# Altium schematic sheet USB.SchDoc: Evaluation Board 3.2
size A3; Organization: Toradex AG; Address1: Altsagenstrasse 5; Address2: Horw; Address3: 6048; Address4: Switzerland; DocumentNumber: 6; Revision: V3.2; SheetNumber: 6; SheetTotal: 23; PageSetup: Record=PageOptions|CenterHorizontal=True|CenterVertical=True|PrintScale=0.73|XCorrection=1.00|YCorrection=1.00|PrintKind=0|BorderSize=5000000|LeftOffset=0|BottomOffset=0|Orientation=2|PaperLength=1000|PaperWidth=1000|Scale=100|PaperSource=7|PrintQuality=-4|MediaType=1|DitherType=10|PaperKind=A4|PrintScaleMode=1
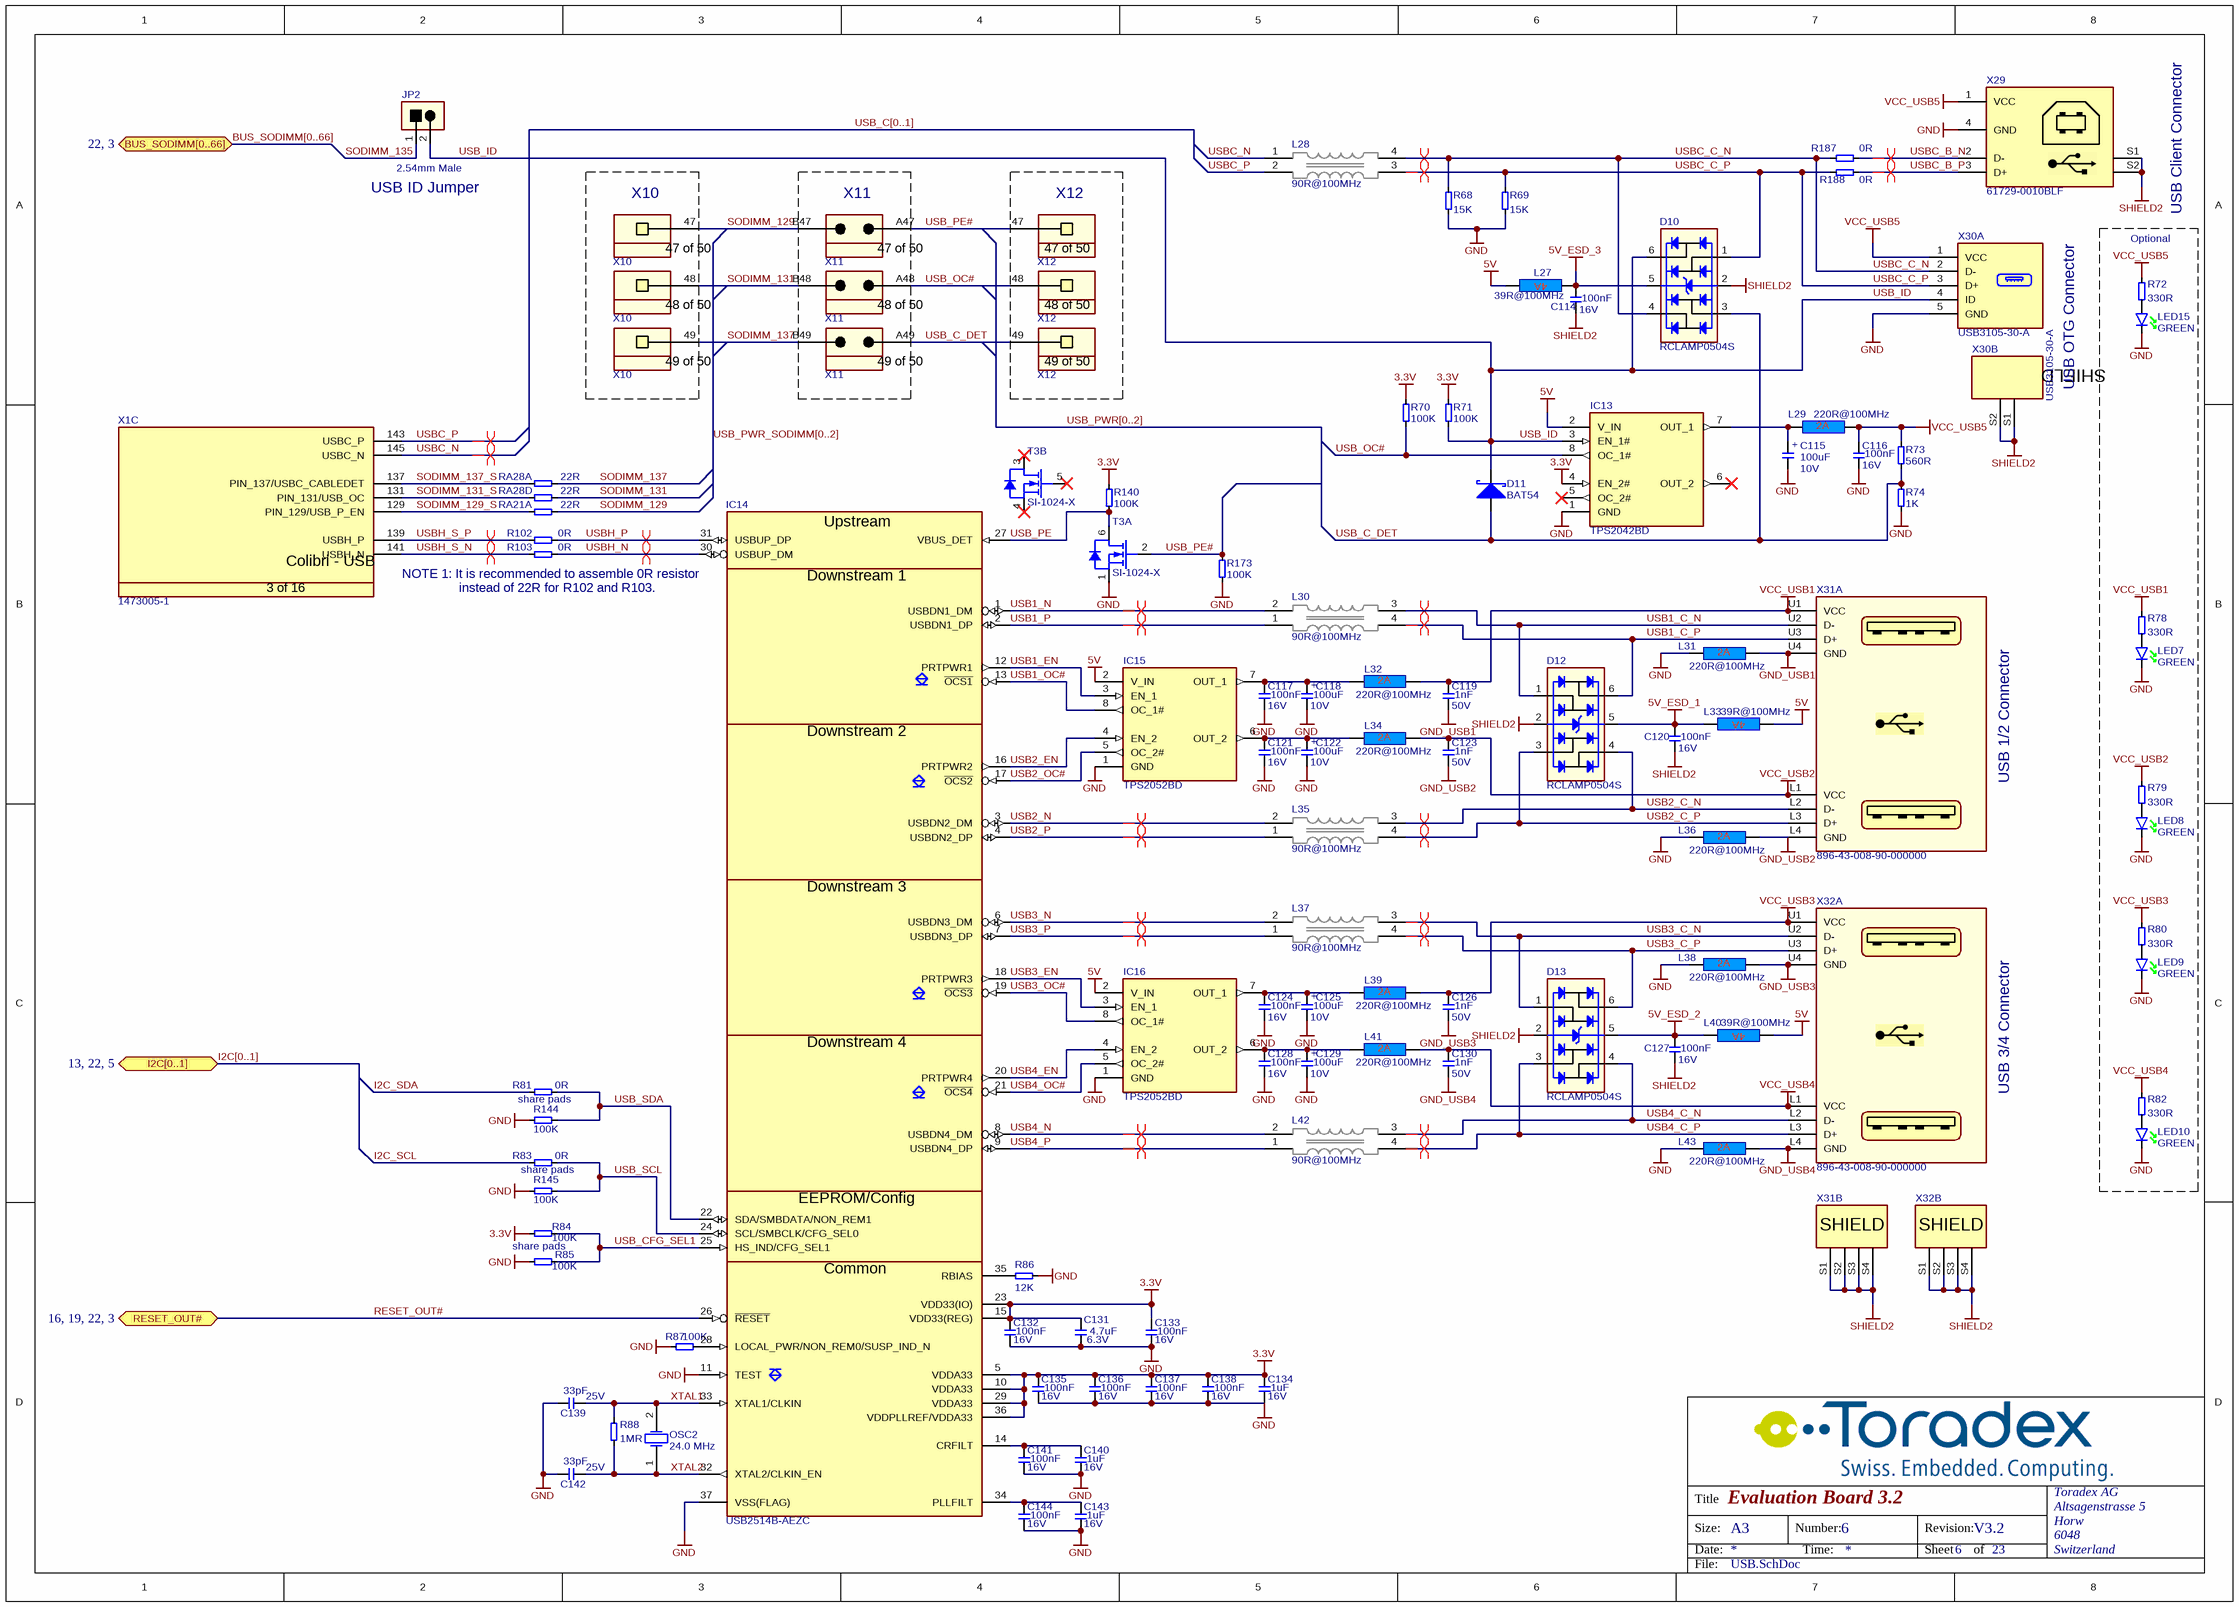
[diagram p0: USB.SchDoc]

## Parts
C114  Rating: 16V  [T_CAPC0603X33N]  (hidden comment: 100nF)
C115  Rating: 10V  [CAPMP6032X280N]  (hidden comment: 100uF)
C116  Rating: 16V  [T_CAPC0603X33N]  (hidden comment: 100nF)
C117  Rating: 16V  [T_CAPC0603X33N]  (hidden comment: 100nF)
C118  Rating: 10V  [CAPMP6032X280N]  (hidden comment: 100uF)
C119  Rating: 50V  [T_CAPC0603X33N]  (hidden comment: 1nF)
C120  Rating: 16V  [T_CAPC0603X33N]  (hidden comment: 100nF)
C121  Rating: 16V  [T_CAPC0603X33N]  (hidden comment: 100nF)
C122  Rating: 10V  [CAPMP6032X280N]  (hidden comment: 100uF)
C123  Rating: 50V  [T_CAPC0603X33N]  (hidden comment: 1nF)
C124  Rating: 16V  [T_CAPC0603X33N]  (hidden comment: 100nF)
C125  Rating: 10V  [CAPMP6032X280N]  (hidden comment: 100uF)
C126  Rating: 50V  [T_CAPC0603X33N]  (hidden comment: 1nF)
C127  Rating: 16V  [T_CAPC0603X33N]  (hidden comment: 100nF)
C128  Rating: 16V  [T_CAPC0603X33N]  (hidden comment: 100nF)
C129  Rating: 10V  [CAPMP6032X280N]  (hidden comment: 100uF)
C130  Rating: 50V  [T_CAPC0603X33N]  (hidden comment: 1nF)
C131  Rating: 6.3V  [T_CAPC0603X33N]  (hidden comment: 4.7uF)
C132  Rating: 16V  [T_CAPC0603X33N]  (hidden comment: 100nF)
C133  Rating: 16V  [T_CAPC0603X33N]  (hidden comment: 100nF)
C134  Rating: 16V  [T_CAPC0603X33N]  (hidden comment: 1uF)
C135  Rating: 16V  [T_CAPC0603X33N]  (hidden comment: 100nF)
C136  Rating: 16V  [T_CAPC0603X33N]  (hidden comment: 100nF)
C137  Rating: 16V  [T_CAPC0603X33N]  (hidden comment: 100nF)
C138  Rating: 16V  [T_CAPC0603X33N]  (hidden comment: 100nF)
C139  Rating: 25V  [T_CAPC0603X33N]  (hidden comment: 33pF)
C140  Rating: 16V  [T_CAPC0603X33N]  (hidden comment: 1uF)
C141  Rating: 16V  [T_CAPC0603X33N]  (hidden comment: 100nF)
C142  Rating: 25V  [T_CAPC0603X33N]  (hidden comment: 33pF)
C143  Rating: 16V  [T_CAPC0603X33N]  (hidden comment: 1uF)
C144  Rating: 16V  [T_CAPC0603X33N]  (hidden comment: 100nF)
D10  RCLAMP0504S  [T_SOT95P285X90-6N]
D11  BAT54  [SOT95P230X110-3N]
D12  RCLAMP0504S  [T_SOT95P285X90-6N]
D13  RCLAMP0504S  [T_SOT95P285X90-6N]
IC13  TPS2042BD  [SOIC127P600X173-8N]
IC14  Manufacturer Part No.: USB2514B-AEZC  [T_SMSC_USB2514B-AEZC]  (hidden comment: USB2514B)
IC15  TPS2052BD  [SOIC127P600X173-8N]
IC16  TPS2052BD  [SOIC127P600X173-8N]
JP2  TSW-101-07-G-D  [T_Samtec_TSW-101-07-G-D]  (value not drawn)
L27  39R@100MHz  [INDC2013X130N]
L28  90R@100MHz  [T_Murata_DLW21SN900SQ2]
L29  220R@100MHz  [INDC1608X95N]
L30  90R@100MHz  [T_Murata_DLW21SN900SQ2]
L31  220R@100MHz  [INDC1608X95N]
L32  220R@100MHz  [INDC1608X95N]
L33  39R@100MHz  [INDC2013X130N]
L34  220R@100MHz  [INDC1608X95N]
L35  90R@100MHz  [T_Murata_DLW21SN900SQ2]
L36  220R@100MHz  [INDC1608X95N]
L37  90R@100MHz  [T_Murata_DLW21SN900SQ2]
L38  220R@100MHz  [INDC1608X95N]
L39  220R@100MHz  [INDC1608X95N]
L40  39R@100MHz  [INDC2013X130N]
L41  220R@100MHz  [INDC1608X95N]
L42  90R@100MHz  [T_Murata_DLW21SN900SQ2]
L43  220R@100MHz  [INDC1608X95N]
LED7  Color: GREEN  [T_Osram_T670_GREEN]  (hidden comment: LG T670-K1L2-1)
LED8  Color: GREEN  [T_Osram_T670_GREEN]  (hidden comment: LG T670-K1L2-1)
LED9  Color: GREEN  [T_Osram_T670_GREEN]  (hidden comment: LG T670-K1L2-1)
LED10  Color: GREEN  [T_Osram_T670_GREEN]  (hidden comment: LG T670-K1L2-1)
LED15  Color: GREEN  [T_Osram_T670_GREEN]  (hidden comment: LG T670-K1L2-1)
OSC2  value 24.0 MHz  [T_HORIZON-HEX24]  (hidden comment: HEX24-24000MHz-18-50R-F-H2-T2-W2-T)
R68  15K  [T_RESC0603X30N]
R69  15K  [T_RESC0603X30N]
R70  100K  [t_RESC0603X30N]
R71  100K  [t_RESC0603X30N]
R72  330R  [T_RESC0603X30N]
R73  560R  [T_RESC0603X30N]
R74  1K  [T_RESC0603X30N]
R78  330R  [T_RESC0603X30N]
R79  330R  [T_RESC0603X30N]
R80  330R  [T_RESC0603X30N]
R81  0R  [T_RESC0603X30N]
R82  330R  [T_RESC0603X30N]
R83  0R  [T_RESC0603X30N]
R84  100K  [T_RESC0603X30N]
R85  100K  [T_RESC0603X30N]
R86  12K  [T_RESC0603X30N]
R87  100K  [T_RESC0603X30N]
R88  1MR  [T_RESC0603X30N]
R102  0R  [T_RESC0603X30N]
R103  0R  [T_RESC0603X30N]
R140  100K  [T_RESC0603X30N]
R144  100K  [T_RESC0603X30N]
R145  100K  [T_RESC0603X30N]
R173  100K  [T_RESC0603X30N]
R187  0R  [T_RESC0603X30N]
R188  0R  [T_RESC0603X30N]
RA21  22R  [T_Resistor_Array_X4]  (part A of 4)
RA28  22R  [T_Resistor_Array_X4]  (parts A,D of 4)
T3  Manufacturer Part No.: SI-1024-X  [SOTFL50P160X60-6N]  (hidden comment: T-Vishay-SI-1024X-N)  (parts A,B of 2)
X1  Manufacturer Part No.: 1473005-1  [T_Tyco_1473005-1]  (hidden comment: CON-Tyco-1473005-1-200-0.6mm)  (part C of 16)
X10  SSW-110-01-G-S  [T_Samtec_SSW-110-01-G-S]  (value not drawn)  (parts 47,48,49 of 50)
X11  TSW-110-07-G-D  [T_Samtec_TSW-110-07-G-D]  (value not drawn)  (parts 47,48,49 of 50)
X12  SSW-110-01-G-S  [T_Samtec_SSW-110-01-G-S]  (value not drawn)  (parts 47,48,49 of 50)
X29  61729-0010BLF  [T_FCI_61729-0010BLF]
X30  Manufacturer Part No.: USB3105-30-A  [T_GCT_USB3105-30-A]  (hidden comment: CON-GCT-USB3105-30-A)  (parts A,B of 2)
X31  896-43-008-90-000000  [T_MMMC_896-43-008-90-000000]  (parts A,B of 2)
X32  896-43-008-90-000000  [T_MMMC_896-43-008-90-000000]  (parts A,B of 2)

## Blocks framed on the sheet
X10: X10
X11: X11
X12: X12
USB Client Connector: LED7-LED10 LED15 R72 R78-R80 R82

## Ports
BUS_SODIMM[0..66] (bidir, see 22, 3), I2C[0..1] (bidir, see 13, 22, 5), RESET_OUT# (bidir, see 16, 19, 22, 3)

## Nets
3.3V: C131.2 C132.2 C133.2 C134.2 C135.2 C136.2 C137.2 C138.2 IC13.4(EN_2#) IC14.5(VDDA33) IC14.10(VDDA33) IC14.15(VDD33(REG)) IC14.23(VDD33(IO)) IC14.29(VDDA33) IC14.36(VDDPLLREF/VDDA33) R70.2 R71.1 R84.2 R140.2
5V: IC13.2(V_IN) IC15.2(V_IN) IC16.2(V_IN) L27.2 L33.1 L40.1
5V_ESD_1: C120.2 D12.5 L33.2
5V_ESD_2: C127.2 D13.5 L40.2
5V_ESD_3: C114.2 D10.5 L27.1
GND: C115.2 C116.1 C117.1 C118.2 C121.1 C122.2 C124.1 C125.2 C128.1 C129.2 C131.1 C132.1 C133.1 C134.1 C135.1 C136.1 C137.1 C138.1 C139.1 C140.1 C141.1 C142.1 C143.1 C144.1 IC13.1(GND) IC14.11(TEST) IC14.37(VSS(FLAG)) IC15.1(GND) IC16.1(GND) L31.1 L36.1 L38.1 L43.1 LED7.K LED8.K LED9.K LED10.K LED15.K R68.1 R69.1 R74.1 R85.2 R86.1 R87.1 R144.2 R145.2 R173.1 T3.1(S) X29.4(GND) X30.5(GND)
GND_USB1: C119.1 L31.2 X31.U4(GND)
GND_USB2: C123.1 L36.2 X31.L4(GND)
GND_USB3: C126.1 L38.2 X32.U4(GND)
GND_USB4: C130.1 L43.2 X32.L4(GND)
SHIELD2: C114.1 C120.1 C127.1 D10.2 D12.2 D13.2 X29.S1 X29.S2 X30.S1(SHIELD) X30.S2(SHIELD) X31.S1(SHIELD) X31.S2(SHIELD) X31.S3(SHIELD) X31.S4(SHIELD) X32.S1(SHIELD) X32.S2(SHIELD) X32.S3(SHIELD) X32.S4(SHIELD)
VCC_USB1: C119.2 L32.2 R78.2 X31.U1(VCC)
VCC_USB2: C123.2 L34.2 R79.2 X31.L1(VCC)
VCC_USB3: C126.2 L39.2 R80.2 X32.U1(VCC)
VCC_USB4: C130.2 L41.2 R82.2 X32.L1(VCC)
VCC_USB5: C116.2 L29.2 R72.2 R73.2 X29.1(VCC) X30.1(VCC)
I2C_SCL: R83.1
I2C_SDA: R81.1
RESET_OUT#: IC14.26(~{RESET}) ; port RESET_OUT#
SODIMM_129: RA21.5 X10.47 X11.B47
SODIMM_129_S: RA21.1 X1.129(PIN_129/USB_P_EN)
SODIMM_131: RA28.8 X10.48 X11.B48
SODIMM_131_S: RA28.4 X1.131(PIN_131/USB_OC)
SODIMM_135: JP2.1
SODIMM_137: RA28.5 X10.49 X11.B49
SODIMM_137_S: RA28.1 X1.137(PIN_137/USBC_CABLEDET)
USB1_C_N: D12.1 L30.3 X31.U2(D-)
USB1_C_P: D12.6 L30.4 X31.U3(D+)
USB1_EN: IC14.12(PRTPWR1) IC15.3(EN_1)
USB1_N: IC14.1(USBDN1_DM) L30.2
USB1_OC#: IC14.13(~{OCS1}) IC15.8(OC_1#)
USB1_P: IC14.2(USBDN1_DP) L30.1
USB2_C_N: D12.4 L35.3 X31.L2(D-)
USB2_C_P: D12.3 L35.4 X31.L3(D+)
USB2_EN: IC14.16(PRTPWR2) IC15.4(EN_2)
USB2_N: IC14.3(USBDN2_DM) L35.2
USB2_OC#: IC14.17(~{OCS2}) IC15.5(OC_2#)
USB2_P: IC14.4(USBDN2_DP) L35.1
USB3_C_N: D13.1 L37.3 X32.U2(D-)
USB3_C_P: D13.6 L37.4 X32.U3(D+)
USB3_EN: IC14.18(PRTPWR3) IC16.3(EN_1)
USB3_N: IC14.6(USBDN3_DM) L37.2
USB3_OC#: IC14.19(~{OCS3}) IC16.8(OC_1#)
USB3_P: IC14.7(USBDN3_DP) L37.1
USB4_C_N: D13.4 L42.3 X32.L2(D-)
USB4_C_P: D13.3 L42.4 X32.L3(D+)
USB4_EN: IC14.20(PRTPWR4) IC16.4(EN_2)
USB4_N: IC14.8(USBDN4_DM) L42.2
USB4_OC#: IC14.21(~{OCS4}) IC16.5(OC_2#)
USB4_P: IC14.9(USBDN4_DP) L42.1
USB_C_DET: D10.3 D11.1 R73.1 R74.2 X11.A49 X12.49
USB_CFG_SEL1: IC14.25(HS_IND/CFG_SEL1) R84.1 R85.1
USB_ID: D10.6 D11.3 IC13.3(EN_1#) JP2.2 R71.2 X30.4(ID)
USB_OC#: IC13.8(OC_1#) R70.1 X11.A48 X12.48
USB_PE: IC14.27(VBUS_DET) R140.1 T3.6(D)
USB_PE#: R173.2 T3.2(G) X11.A47 X12.47
USB_SCL: IC14.24(SCL/SMBCLK/CFG_SEL0) R83.2 R145.1
USB_SDA: IC14.22(SDA/SMBDATA/NON_REM1) R81.2 R144.1
USBC_B_N: R187.2 X29.2(D-)
USBC_B_P: R188.2 X29.3(D+)
USBC_C_N: D10.4 L28.4 R68.2 R187.1 X30.2(D-)
USBC_C_P: D10.1 L28.3 R69.2 R188.1 X30.3(D+)
USBC_N: L28.1 X1.145(USBC_N)
USBC_P: L28.2 X1.143(USBC_P)
USBH_N: IC14.30(USBUP_DM) R103.2
USBH_P: IC14.31(USBUP_DP) R102.2
USBH_S_N: R103.1 X1.141(USBH_N)
USBH_S_P: R102.1 X1.139(USBH_P)
XTAL1: C139.2 IC14.33(XTAL1/CLKIN) OSC2.2(OSC2) R88.2
XTAL2: C142.2 IC14.32(XTAL2/CLKIN_EN) OSC2.1(OSC1) R88.1
NetC115_1: C115.1 IC13.7(OUT_1) L29.1
NetC117_2: C117.2 C118.1 IC15.7(OUT_1) L32.1
NetC121_2: C121.2 C122.1 IC15.6(OUT_2) L34.1
NetC124_2: C124.2 C125.1 IC16.7(OUT_1) L39.1
NetC128_2: C128.2 C129.1 IC16.6(OUT_2) L41.1
NetC140_2: C140.2 C141.2 IC14.14(CRFILT)
NetC143_2: C143.2 C144.2 IC14.34(PLLFILT)
NetIC14_28: IC14.28(LOCAL_PWR/NON_REM0/SUSP_IND_N) R87.2
NetIC14_35: IC14.35(RBIAS) R86.2
NetLED7_A: LED7.A R78.1
NetLED8_A: LED8.A R79.1
NetLED9_A: LED9.A R80.1
NetLED10_A: LED10.A R82.1
NetLED15_A: LED15.A R72.1

Not connected (* = marked no-connect by the designer): IC13 5(OC_2#)* 6(OUT_2)*; T3 3(D)* 4(S)* 5(G)*

## Buses and harness runs
bus BUS_SODIMM[0..66] = port BUS_SODIMM[0..66]
bus I2C[0..1] = port I2C[0..1]
bus USB_C[0..1]
bus USB_PWR[0..2]
bus USB_PWR_SODIMM[0..2]

## Layout directives
differential pair: USB1_C_N, USB1_C_P, USB1_N, USB1_P, USB2_C_N, USB2_C_P, USB2_N, USB2_P, USB3_C_N, USB3_C_P, USB3_N, USB3_P, USB4_C_N, USB4_C_P, USB4_N, USB4_P, USBC_B_N, USBC_B_P, USBC_C_N, USBC_C_P, USBC_N, USBC_P, USBH_N, USBH_P, USBH_S_N, USBH_S_P

## Notes on the sheet
- (near JP2) USB ID Jumper
- (near JP2) 2.54mm Male
- (near R72) Optional
- USB OTG Connector
- NOTE 1: It is recommended to assemble 0R resistor
- instead of 22R for R102 and R103.
- USB 1/2 Connector
- (near R81) share pads
- USB 3/4 Connector
- (near R83) share pads
- share pads
- Title
- Size:
- Date:
- A3
- Number:
- Time:
- Revision:
- Sheet
- of
- File:
- (in symbol C-TA-100uF-10V-10%-6032) +
- (in symbol CON-Samtec-SSW-110-01-G-S, part 47) 47 of 50
- (in symbol CON-Samtec-SSW-110-01-G-S, part 48) 48 of 50
- (in symbol CON-Samtec-SSW-110-01-G-S, part 49) 49 of 50
- (in symbol CON-Samtec-TSW-110-07-G-D, part 47) 47 of 50
- (in symbol CON-Samtec-TSW-110-07-G-D, part 48) 48 of 50
- (in symbol CON-Samtec-TSW-110-07-G-D, part 49) 49 of 50
- (in symbol CON-Tyco-1473005-1-200-0.6mm, part C) Colibri - USB; 3 of 16
- (in symbol IC-SMSC-USB2514B-AEZC) Upstream; Downstream 1; Downstream 2; Downstream 3; Downstream 4; EEPROM/Config; Common

## Library data of the parts
C114 C116 C117 C120 C121 C124 C127 C128 C132 C133 C135-C138 C141 C144 = C-X7R-100nF-16V-10%-0603: Capacitor Ceramic X7R 100nF 16V 10% 0603; Tolerance: 10%; Type: X7R; Value: 100nF
C115 C118 C122 C125 C129 = C-TA-100uF-10V-10%-6032: Capacitor TA 100uF 10V 10% 6032; Tolerance: 10%; Type: TA; Value: 100uF
C119 C123 C126 C130 = C-X7R-1nF-50V-10%-0603: Capacitor Ceramic X7R 1nF 50V 10% 0603; Tolerance: 10%; Type: X7R; Value: 1nF
C131 = C-X5R-4.7uF-6.3V-20%-0603: Capacitor Ceramic X5R 4.7uF 6.3V 20% 0603; Tolerance: 20%; Type: X5R; Value: 4.7uF
C134 C140 C143 = C-X5R-1uF-16V-20%-0603: Capacitor Ceramic X5R 1uF 16V 20% 0603; Tolerance: 20%; Type: X5R; Value: 1uF
C139 C142 = C-NP0-33pF-25V-10%-0603: Capacitor Ceramic NP0 33pF 25V 10% 0603; Tolerance: 10%; Type: NP0; Value: 33pF
D10 D12 D13 = D-Semtech-RClamp0504S: TVS Array low cap; Manufacturer Name: Semtech; Manufacturer Part No.: RCLAMP0504S
D11 = D-Philips-BAT54-Schottky: BAT54 Schottky Diode; Manufacturer Name: Philips; Manufacturer Part No.: BAT54
IC13 = IC-TI-TPS2042BD: Dual High Side Switch With OC_DET 500mA/CH; Manufacturer Name: Texas Instruments; Manufacturer Part No.: TPS2042BD
IC14 = IC-SMSC-USB2514B-AEZC: 4 Port USB HUB; Manufacturer Name: SMSC
IC15 IC16 = IC-TI-TPS2052BD: Dual High Side Switch With OC_DET 500mA/CH; Manufacturer Name: Texas Instruments; Manufacturer Part No.: TPS2052BD
JP2 = CON-Samtec-TSW-101-07-G-D: Header male, 1x2 Pins, 2.54 mm pitch; Manufacturer Name: Samtec; Pitch: 2.54 mm; No. of ways: 1x2; Manufacturer Part no.: TSW-101-07-G-D
L27 L33 L40 = L-Panasonic-EXC-ML20A390U-39R@100MHz-4A-25%-0805: 39R@100MHz 4A EMI FILTER; Tolerance: 25%; Rating: 4A; Manufacturer Name: Panasonic; Manufacturer Name: EXC-ML20A390U; Value: 39R@100MHz
L28 L30 L35 L37 L42 = L-Murata-DLW21SN900SQ2-90R@100MHz-330mA-25%: Common Mode Choke High Speed 90R 330mA; Manufacturer Name: Murata; Tolerance: 25%; Rating: 330mA; Manufacturer Part No.: DLW21SN900SQ2; Value: 90R@100MHz
L29 L31 L32 L34 L36 L38 L39 L41 L43 = L-220R@100MHz-2A-25%-0603: 220R@100MHz 2A EMI FILTER; Tolerance: 25%; Rating: 2A; Value: 220R@100MHz
LED7-LED10 LED15 = LED-Osram-T670-K1L2-1: LED green Osram LG T670-K1L2-1; Manufacturer Part N.: LG T670-K1L2-1; Manufacturer Name: Osram
OSC2 = OSC-HORIZON-HEX24-24000MHz-18-50R-F-H2-T2-W2-T: Quartz 24.0 MHz; Tolerance: 30ppm; Manufacturer Name: HORIZON; Manufacturer Part No.: HEX24-24000MHz-18-50R-F-H2-T2-W2-T
R68 R69 = R-15KR-63mW-5%-0603: Resistor 15 Kohm 63mW 5% 0603; Value: 15KR; Rating: 63mW; Tolerance: 5%
R70 R71 R84 R85 R87 R140 R144 R145 R173 = R-100KR-63mW-5%-0603: Resistor 100 Kohm 63mW 5% 0603; Value: 100KR; Rating: 63mW; Tolerance: 5%
R72 R78-R80 R82 = R-330R-63mW-5%-0603: Resistor 330 ohm 63mW 5% 0603; Rating: 63mW; Tolerance: 5%; Value: 330R
R73 = R-560R-63mW-5%-0603: Resistor 560 ohm 63mW 5% 0603; Rating: 63mW; Tolerance: 5%; Value: 560R
R74 = R-1KR-63mW-5%-0603: Resistor 1 Kohm 63mW 5% 0603; Rating: 63mW; Tolerance: 5%; Value: 1K
R81 R83 R102 R103 R187 R188 = R-0R-63mW-1%-0603: Resistor 0 ohm 63mW 1% 0603; Rating: 63mW; Tolerance: 1%; Value: 0R
R86 = R-12KR-63mW-1%-0603: Resistor 12 Kohm 63mW 1% 0603; Value: 12KR; Rating: 63mW; Tolerance: 1%
R88 = R-1MR-63mW-5%-0603: Resistor 1Mohm 63mW 5% 0603; Rating: 63mW; Tolerance: 5%; Value: 1MR
RA21 RA28 = RA-22R-63mW-5%-1206-div: Resistor Array 22 R 63mW 5% 1206; Tolerance: 5%; Power Dissipation: 63mW; Value: 22R
T3 = T-Vishay-SI-1024X-N: Dual N-Channel 20V (D-S)  MOSFET; Manufacturer Name: Vishay
X1 = CON-Tyco-1473005-1-200-0.6mm: SODIMM Connector; Manufacturer Name: Tyco; No. of ways: 200
X10 X12 = CON-Samtec-SSW-110-01-G-S: Header 1x50 pin 2.54mm pitch; Manufacturer Name: Samtec; Pitch: 2.54mm; No. of ways: 1x50; Manufacturer Part No.: SSW-110-01-G-S
X11 = CON-Samtec-TSW-110-07-G-D: Header 2x50 pin 2.54mm pitch; Manufacturer Name: Samtec; Pitch: 2.54mm; No. of ways: 2x50; Manufacturer Part No.: TSW-110-07-G-D
X29 = CON-FCI-61729-0010BLF: USB Type B Connector; Manufacturer Name: FCI; No. of ways: 4; Manufacturer Part No.: 61729-0010BLF
X30 = CON-GCT-USB3105-30-A: Micro USB OTG Connector - TH - Vertical; Manufacturer Name: GCT; No. of ways: 5
X31 X32 = CON-MMMC-896-43-008-90-000000: USB 2.0 double row, Type A; Manufacturer Name: Mill-Max Mfg. Corp.; No. of ways: 8; Manufacturer Part No.: 896-43-008-90-000000